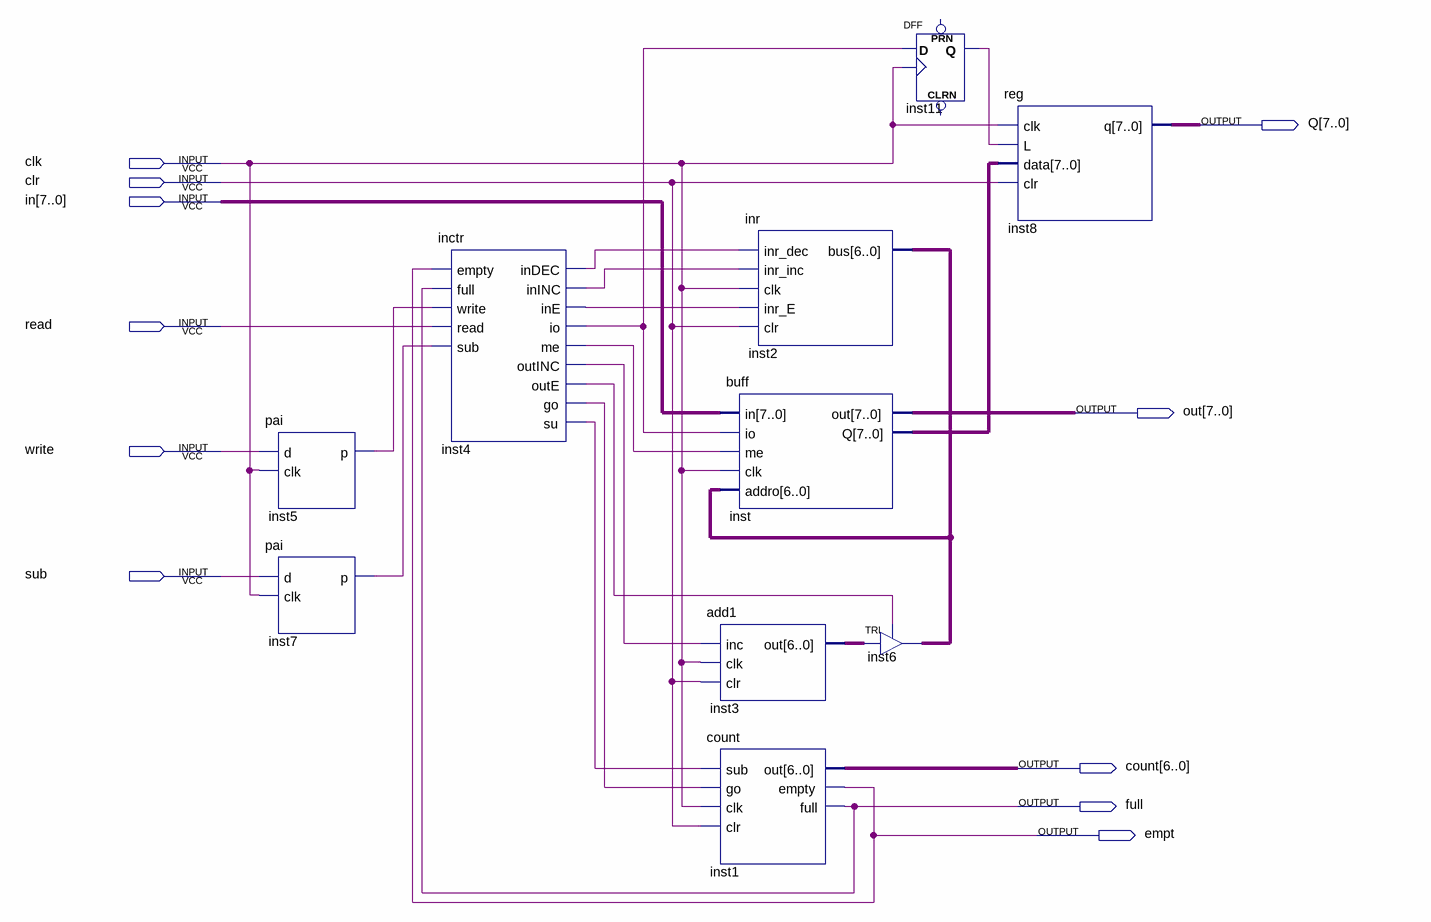
[diagram p0: schematic sheet]
// Quartus schematic inputa.bdf as structural Verilog: 10 symbols, 11 pins
module inputa (
  input  clk,
  input  clr,
  input  [7:0] in,
  input  read,
  input  write,
  input  sub,
  output [7:0] Q,
  output [7:0] out,
  output [6:0] count,
  output full,
  output empt
);

  wire inst4_go, inst4_indec, inst4_ine, inst4_ininc, inst4_io, inst4_me, inst4_oute, inst4_outinc, inst4_su,
       inst5_p, inst7_p, inst11_q;
  wire [6:0] inst2_bus, inst3_out;
  wire [7:0] inst_q;

  pai inst5 (.d(write), .clk(clk), .p(inst5_p));
  pai inst7 (.d(sub), .clk(clk), .p(inst7_p));
  inctr inst4 (
    .empty(empt), .full(full), .write(inst5_p), .read(read), .sub(inst7_p), .inDEC(inst4_indec),
    .inINC(inst4_ininc), .inE(inst4_ine), .io(inst4_io), .me(inst4_me), .outINC(inst4_outinc),
    .outE(inst4_oute), .go(inst4_go), .su(inst4_su));
  add1 inst3 (.inc(inst4_outinc), .clk(clk), .clr(clr), .out(inst3_out));
  count inst1 (.sub(inst4_su), .go(inst4_go), .clk(clk), .clr(clr), .out(count), .empty(empt), .full(full));
  inr inst2 (.inr_dec(inst4_indec), .inr_inc(inst4_ininc), .clk(clk), .inr_E(inst4_ine), .clr(clr), .bus(inst2_bus));
  buff inst (.in(in), .io(inst4_io), .me(inst4_me), .clk(clk), .addro(inst2_bus), .out(out), .Q(inst_q));
  DFF inst11 (.CLK(clk), .D(inst4_io), .Q(inst11_q));  // open: CLRN, PRN
  TRI inst6[6:0] (.IN(inst3_out), .OE(inst4_oute), .OUT(inst2_bus));
  \reg  inst8 (.clk(clk), .L(inst11_q), .data(inst_q), .clr(clr), .q(Q));
endmodule
